# Altium schematic sheet FMC_130MSPS_4CH.SchDoc: FMC 130MSPS 4CH
size 420 x 297 mm; SheetNumber: 1; SheetTotal: 8
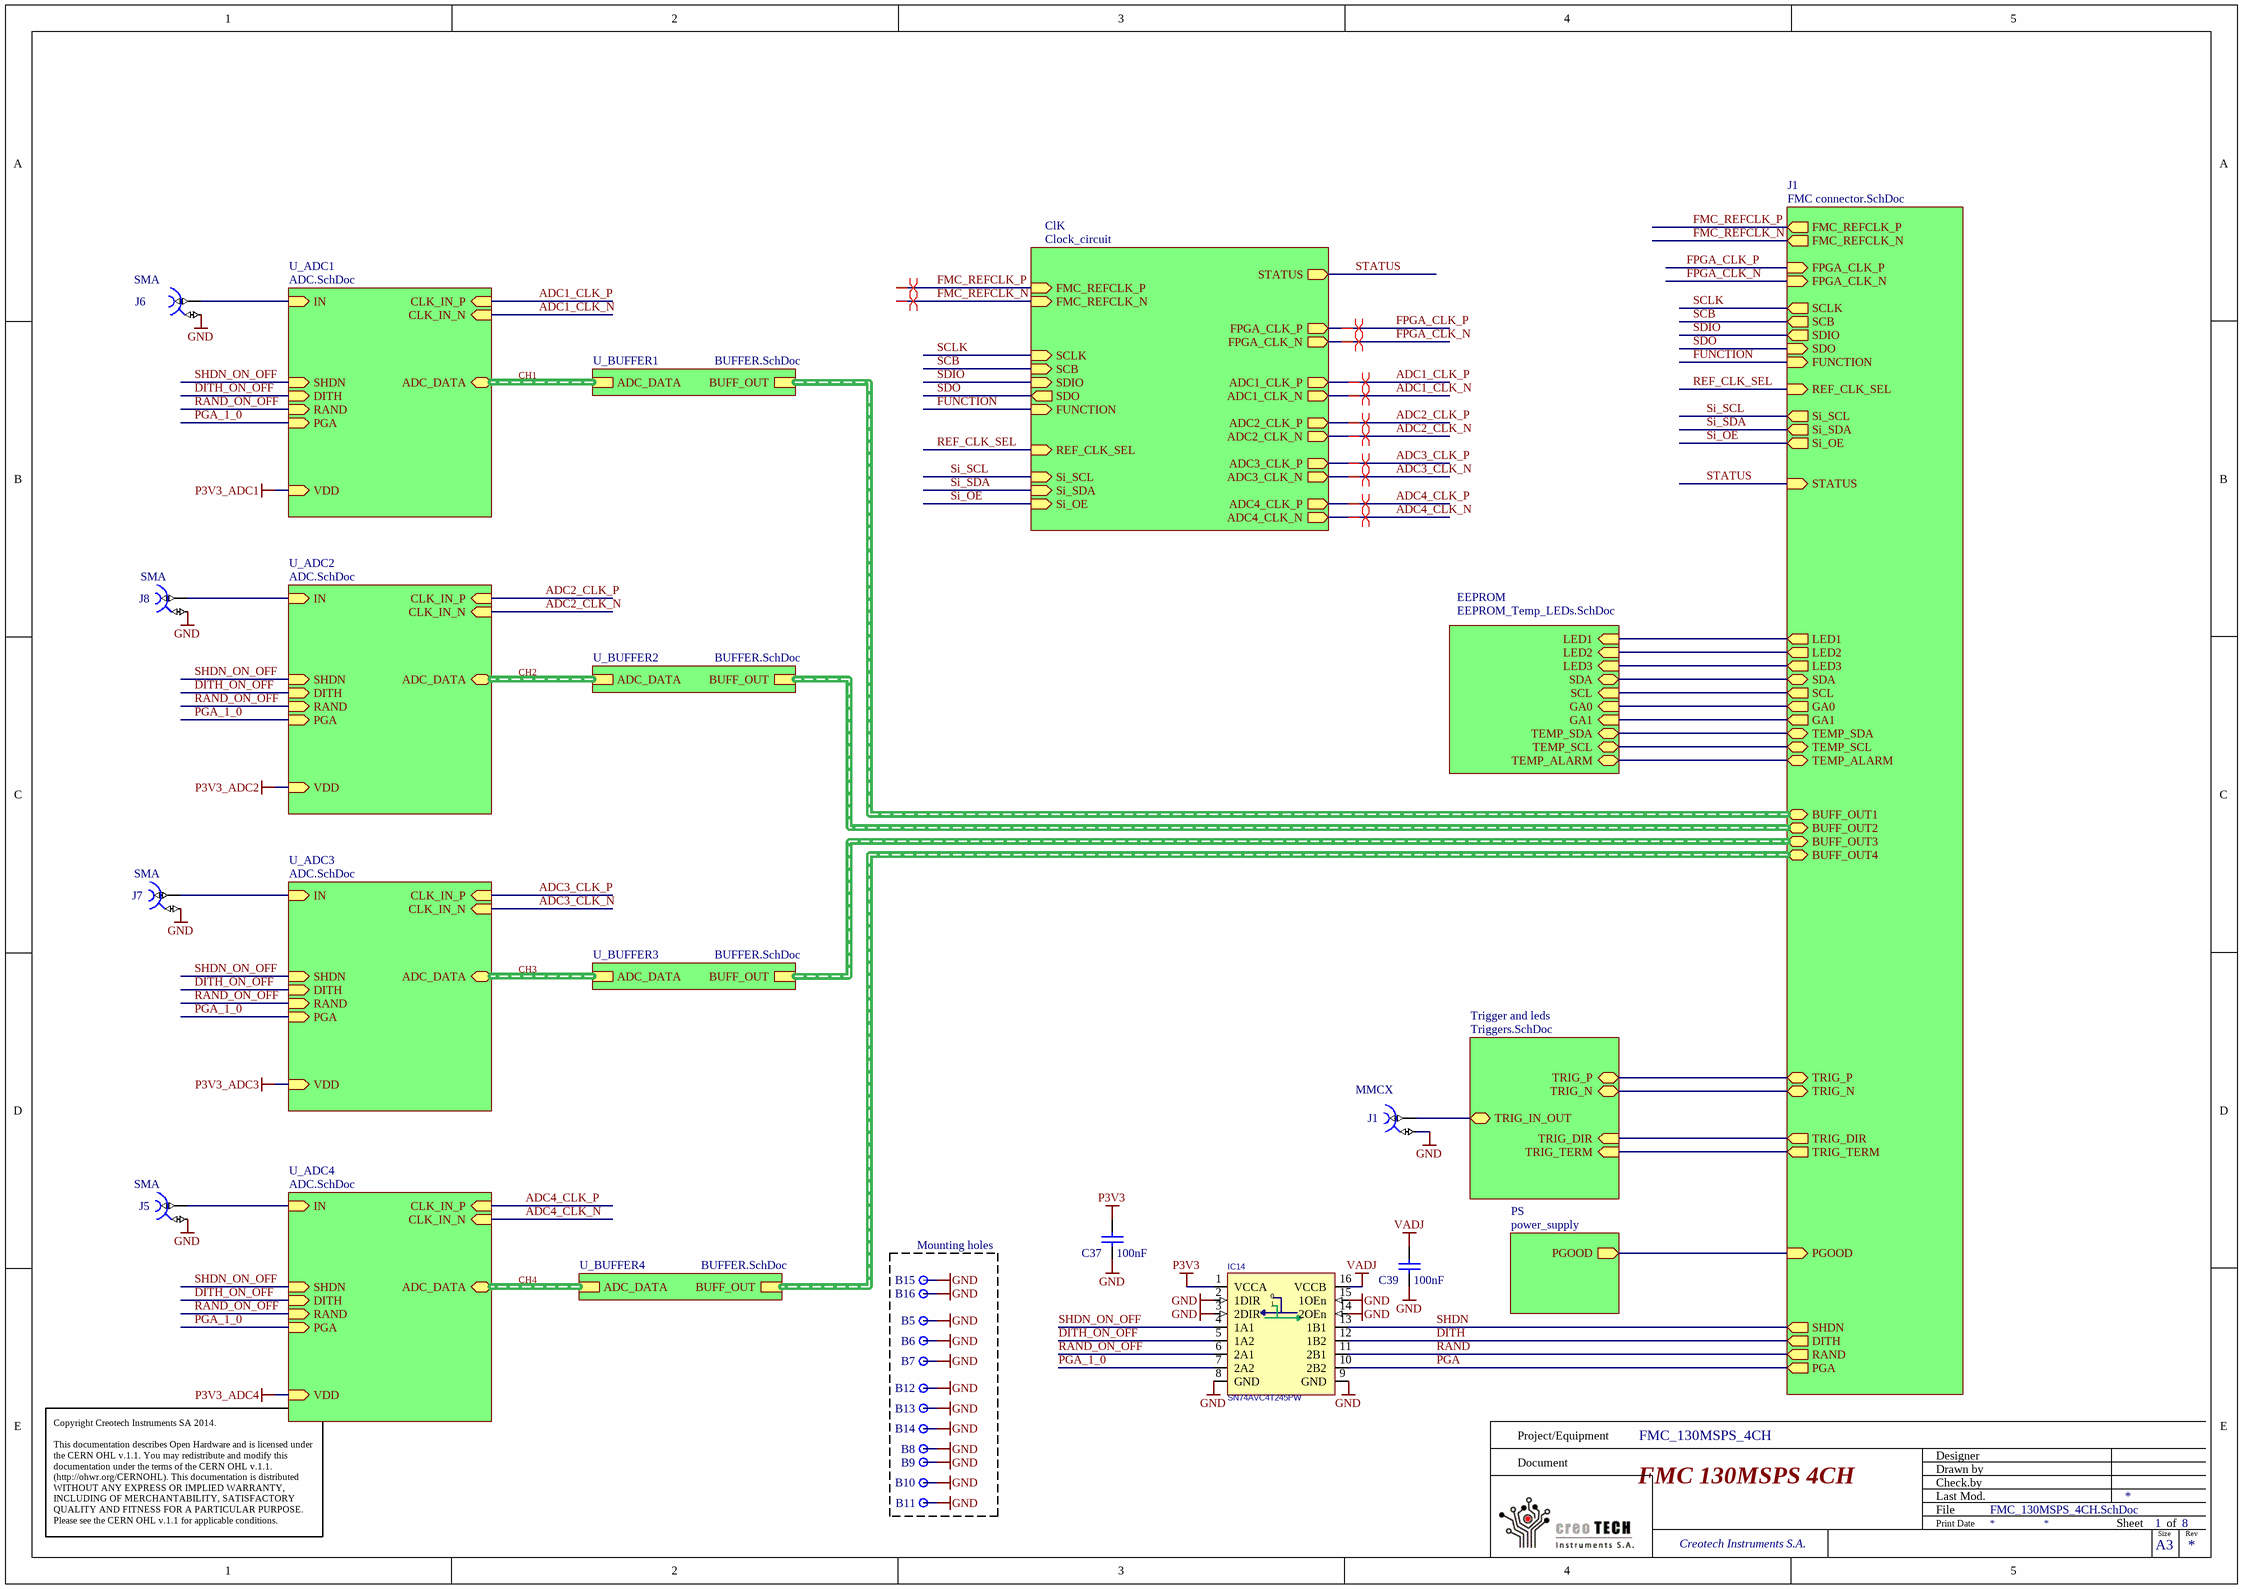
[diagram p0: FMC_130MSPS_4CH.SchDoc]

## Parts
B5  Plated Hole  [MTG240_400]  (value not drawn)  (no BOM)
B6  Plated Hole  [MTG240_400]  (value not drawn)  (no BOM)
B7  Plated Hole  [MTG240_400]  (value not drawn)  (no BOM)
B8  Plated Hole  [MTG240_400]  (value not drawn)  (no BOM)
B9  Plated Hole  [MTG240_400]  (value not drawn)  (no BOM)
B10  Plated Hole  [MTG240_400]  (value not drawn)  (no BOM)
B11  Plated Hole  [MTG240_400]  (value not drawn)  (no BOM)
B12  Plated Hole  [MTG240_400]  (value not drawn)  (no BOM)
B13  Plated Hole  [MTG240_400]  (value not drawn)  (no BOM)
B14  Plated Hole  [MTG240_400]  (value not drawn)  (no BOM)
B15  Plated Hole  [MTG240_400]  (value not drawn)  (no BOM)
B16  Plated Hole  [MTG240_400]  (value not drawn)  (no BOM)
C37  100nF  [CAPC0603X33N]
C39  100nF  [CAPC0603X33N]
IC14  SN74AVC4T245PW  [TSSOP-16]
J1  Family: MMCX  [HUBER-SUHNER_85_MMCX-50-0-1/111 OH]  (hidden comment: Coax_1Female_1Shield)
J5  Family: SMA  [JOHNSON_142-0711-301]  (hidden comment: Coax_1Female_1Shield)
J6  Family: SMA  [JOHNSON_142-0711-301]  (hidden comment: Coax_1Female_1Shield)
J7  Family: SMA  [JOHNSON_142-0711-301]  (hidden comment: Coax_1Female_1Shield)
J8  Family: SMA  [JOHNSON_142-0711-301]  (hidden comment: Coax_1Female_1Shield)

## Blocks framed on the sheet
Mounting holes: B5-B16

## Sub-sheets
ClK = Clock_circuit: FPGA_CLK_P (out), FPGA_CLK_N (out), Si_SDA (in), Si_SCL (in), Si_OE (in), ADC1_CLK_P (out), ADC1_CLK_N (out), ADC2_CLK_P (out), ADC2_CLK_N (out), ADC3_CLK_P (out), ADC3_CLK_N (out), ADC4_CLK_P (out), ADC4_CLK_N (out), SCLK (in), SCB (in), SDIO (in), SDO (out), STATUS (out), FUNCTION (in), FMC_REFCLK_P (in), FMC_REFCLK_N (in), REF_CLK_SEL (in)
EEPROM = EEPROM_Temp_LEDs.SchDoc: LED1 (in), LED2 (in), SDA (bidir), SCL (in), GA0 (in), GA1 (in), LED3 (in), TEMP_SDA (bidir), TEMP_SCL (bidir), TEMP_ALARM (bidir)
J1 = FMC connector.SchDoc: BUFF_OUT1 (harness BUFF_OUT), BUFF_OUT2 (harness BUFF_OUT), BUFF_OUT4 (harness BUFF_OUT), BUFF_OUT3 (harness BUFF_OUT), SHDN (out), DITH (out), RAND (out), PGA (out), PGOOD (in), TRIG_DIR (out), TRIG_TERM (out), FMC_REFCLK_P (out), FMC_REFCLK_N (out), Si_SDA (out), Si_SCL (out), Si_OE (out), SCLK (out), SCB (out), SDIO (out), SDO (in), FUNCTION (in), STATUS (in), FPGA_CLK_P (in), FPGA_CLK_N (in), TRIG_N (bidir), TRIG_P (bidir), REF_CLK_SEL (in), LED1 (out), LED2 (out), SDA (bidir), SCL (out), GA0 (out), GA1 (out), LED3 (out), TEMP_SDA (bidir), TEMP_SCL (bidir), TEMP_ALARM (bidir)
PS = power_supply: PGOOD (out)
Trigger and leds = Triggers.SchDoc: TRIG_DIR (in), TRIG_N (bidir), TRIG_P (bidir), TRIG_TERM (in), TRIG_IN_OUT (bidir)
U_ADC1 = ADC.SchDoc: SHDN (in), IN (in), DITH (in), RAND (in), VDD, CLK_IN_P (in), CLK_IN_N (in), PGA (in), ADC_DATA (harness ADC_DATA)
U_ADC2 = ADC.SchDoc: SHDN (in), IN (in), DITH (in), RAND (in), VDD, CLK_IN_P (in), CLK_IN_N (in), PGA (in), ADC_DATA (harness ADC_DATA)
U_ADC3 = ADC.SchDoc: SHDN (in), IN (in), DITH (in), RAND (in), VDD, CLK_IN_P (in), CLK_IN_N (in), PGA (in), ADC_DATA (harness ADC_DATA)
U_ADC4 = ADC.SchDoc: SHDN (in), IN (in), DITH (in), RAND (in), VDD, CLK_IN_P (in), CLK_IN_N (in), PGA (in), ADC_DATA (harness ADC_DATA)
U_BUFFER1 = BUFFER.SchDoc: BUFF_OUT (harness BUFF_OUT), ADC_DATA (harness ADC_DATA)
U_BUFFER2 = BUFFER.SchDoc: BUFF_OUT (harness BUFF_OUT), ADC_DATA (harness ADC_DATA)
U_BUFFER3 = BUFFER.SchDoc: BUFF_OUT (harness BUFF_OUT), ADC_DATA (harness ADC_DATA)
U_BUFFER4 = BUFFER.SchDoc: BUFF_OUT (harness BUFF_OUT), ADC_DATA (harness ADC_DATA)

## Nets
GND: B5.1 B6.1 B7.1 B8.1 B9.1 B10.1 B11.1 B12.1 B13.1 B14.1 B15.1 B16.1 C37.1 C39.1 IC14.2(1DIR) IC14.3(2DIR) IC14.8(GND) IC14.9(GND) IC14.14(2OEn) IC14.15(1OEn) J1.2 J5.2 J6.2 J7.2 J8.2
P3V3: C37.2 IC14.1(VCCA)
P3V3_ADC1: sheet U_ADC1/VDD
P3V3_ADC2: sheet U_ADC2/VDD
P3V3_ADC3: sheet U_ADC3/VDD
P3V3_ADC4: sheet U_ADC4/VDD
VADJ: C39.2 IC14.16(VCCB)
ADC1_CLK_N: sheet ClK/ADC1_CLK_N, sheet U_ADC1/CLK_IN_N
ADC1_CLK_P: sheet ClK/ADC1_CLK_P, sheet U_ADC1/CLK_IN_P
ADC2_CLK_N: sheet ClK/ADC2_CLK_N, sheet U_ADC2/CLK_IN_N
ADC2_CLK_P: sheet ClK/ADC2_CLK_P, sheet U_ADC2/CLK_IN_P
ADC3_CLK_N: sheet ClK/ADC3_CLK_N, sheet U_ADC3/CLK_IN_N
ADC3_CLK_P: sheet ClK/ADC3_CLK_P, sheet U_ADC3/CLK_IN_P
ADC4_CLK_N: sheet ClK/ADC4_CLK_N, sheet U_ADC4/CLK_IN_N
ADC4_CLK_P: sheet ClK/ADC4_CLK_P, sheet U_ADC4/CLK_IN_P
DITH: IC14.12(1B2) ; sheet J1/DITH
DITH_ON_OFF: IC14.5(1A2) ; sheet U_ADC1/DITH, sheet U_ADC2/DITH, sheet U_ADC3/DITH, sheet U_ADC4/DITH
FMC_REFCLK_N: sheet J1/FMC_REFCLK_N, sheet ClK/FMC_REFCLK_N
FMC_REFCLK_P: sheet J1/FMC_REFCLK_P, sheet ClK/FMC_REFCLK_P
FPGA_CLK_N: sheet J1/FPGA_CLK_N, sheet ClK/FPGA_CLK_N
FPGA_CLK_P: sheet J1/FPGA_CLK_P, sheet ClK/FPGA_CLK_P
FUNCTION: sheet J1/FUNCTION, sheet ClK/FUNCTION
PGA: IC14.10(2B2) ; sheet J1/PGA
PGA_1_0: IC14.7(2A2) ; sheet U_ADC1/PGA, sheet U_ADC2/PGA, sheet U_ADC3/PGA, sheet U_ADC4/PGA
RAND: IC14.11(2B1) ; sheet J1/RAND
RAND_ON_OFF: IC14.6(2A1) ; sheet U_ADC1/RAND, sheet U_ADC2/RAND, sheet U_ADC3/RAND, sheet U_ADC4/RAND
REF_CLK_SEL: sheet J1/REF_CLK_SEL, sheet ClK/REF_CLK_SEL
SCB: sheet J1/SCB, sheet ClK/SCB
SCLK: sheet J1/SCLK, sheet ClK/SCLK
SDIO: sheet J1/SDIO, sheet ClK/SDIO
SDO: sheet J1/SDO, sheet ClK/SDO
SHDN: IC14.13(1B1) ; sheet J1/SHDN
SHDN_ON_OFF: IC14.4(1A1) ; sheet U_ADC1/SHDN, sheet U_ADC2/SHDN, sheet U_ADC3/SHDN, sheet U_ADC4/SHDN
Si_OE: sheet J1/Si_OE, sheet ClK/Si_OE
Si_SCL: sheet J1/Si_SCL, sheet ClK/Si_SCL
Si_SDA: sheet J1/Si_SDA, sheet ClK/Si_SDA
STATUS: sheet J1/STATUS, sheet ClK/STATUS
NetJ1_1: J1.1 ; sheet Trigger and leds/TRIG_IN_OUT
NetJ5_1: J5.1 ; sheet U_ADC4/IN
NetJ6_1: J6.1 ; sheet U_ADC1/IN
NetJ7_1: J7.1 ; sheet U_ADC3/IN
NetJ8_1: J8.1 ; sheet U_ADC2/IN
(unnamed): sheet PS/PGOOD, sheet J1/PGOOD
(unnamed): sheet J1/TRIG_DIR, sheet Trigger and leds/TRIG_DIR
(unnamed): sheet J1/TRIG_TERM, sheet Trigger and leds/TRIG_TERM
(unnamed): sheet J1/TRIG_N, sheet Trigger and leds/TRIG_N
(unnamed): sheet J1/TRIG_P, sheet Trigger and leds/TRIG_P
(unnamed): sheet J1/LED1, sheet EEPROM/LED1
(unnamed): sheet J1/LED2, sheet EEPROM/LED2
(unnamed): sheet J1/SDA, sheet EEPROM/SDA
(unnamed): sheet J1/SCL, sheet EEPROM/SCL
(unnamed): sheet J1/GA0, sheet EEPROM/GA0
(unnamed): sheet J1/GA1, sheet EEPROM/GA1
(unnamed): sheet J1/LED3, sheet EEPROM/LED3
(unnamed): sheet J1/TEMP_SDA, sheet EEPROM/TEMP_SDA
(unnamed): sheet J1/TEMP_SCL, sheet EEPROM/TEMP_SCL
(unnamed): sheet J1/TEMP_ALARM, sheet EEPROM/TEMP_ALARM

## Buses and harness runs
harness CH1 = sheet U_ADC1/ADC_DATA = sheet U_BUFFER1/ADC_DATA
harness CH2 = sheet U_ADC2/ADC_DATA = sheet U_BUFFER2/ADC_DATA
harness CH3 = sheet U_ADC3/ADC_DATA = sheet U_BUFFER3/ADC_DATA
harness CH4 = sheet U_ADC4/ADC_DATA = sheet U_BUFFER4/ADC_DATA
harness sheet J1/BUFF_OUT1 = sheet U_BUFFER1/BUFF_OUT
harness sheet J1/BUFF_OUT2 = sheet U_BUFFER2/BUFF_OUT
harness sheet J1/BUFF_OUT3 = sheet U_BUFFER3/BUFF_OUT
harness sheet J1/BUFF_OUT4 = sheet U_BUFFER4/BUFF_OUT

## Layout directives
differential pair: ADC1_CLK_N, ADC1_CLK_P, ADC2_CLK_N, ADC2_CLK_P, ADC3_CLK_N, ADC3_CLK_P, ADC4_CLK_N, ADC4_CLK_P, FMC_REFCLK_N, FMC_REFCLK_P, FPGA_CLK_N, FPGA_CLK_P

## Notes on the sheet
- Project/Equipment
- Document
- FMC_130MSPS_4CH
- Designer
- Drawn by
- Check.by
- Copyright Creotech Instruments SA 2014.
  This documentation describes Open Hardware and is licensed under the CERN OHL v.1.1. You may redistribute and modify this documentation under the terms of the CERN OHL v.1.1. (http://ohwr.org/CERNOHL). This documentation is distributed WITHOUT ANY EXPRESS OR IMPLIED WARRANTY, INCLUDING OF MERCHANTABILITY, SATISFACTORY QUALITY AND FITNESS FOR A PARTICULAR PURPOSE. Please see the CERN OHL v.1.1 for applicable conditions.
- Creotech Instruments S.A.
- File
- Last Mod.
- Print Date
- Sheet
- Size
- A3
- of
- Rev
- (in symbol 74AVC4T245) 0

## Library data of the parts
B5-B16 = PLATED_HOLE2.4_PAD4.0: Single Terminal Socket; Part Description: Plated Through Hole: Hole Dia.=2.4mm Pad Dia.=4.0mm; Mounted: No; Table: Pads; Part Number: PLATED_HOLE2.4_PAD4.0; Component Type: Standard (No BOM); Pin Count: 1; Family: Plated Hole; Socket: No; SMD: No; Status: None; ComponentHeight: 0mm; Author: CERN DEM JMW; CreateDate: 2011-10-10; LatestRevisionDate: 2011-10-10; PackageDescription: Plated Through Hole: Hole Dia.=2.4mm Pad Dia.=4.0mm
C37 C39 = CC0201_100NF_6.3V_10%_X5R: Non-polarised capacitor; Part Description: SMD Multilayer Chip Ceramic Capacitor; Manufacturer: GENERIC; Manufacturer1 Part Number: 02016D104KAT2A; Voltage: 6.3V; TC: X5R; Tolerance: ±10%; Table: Capacitors SMD; Part Number: CC0201_100NF_6.3V_10%_X5R; Component Kind: Standard; Component Type: Standard; Pin Count: 2; Value: 100nF; Status: Not Recommended; Manufacturer Part Number: CC0201_100NF_6.3V_10%_X5R; Case: 0201; Mounted: Yes; Socket: No; SMD: Yes; Manufacturer1 Example: AVX; Manufacturer1 ComponentHeight: 0.33mm; HelpURL: \\cern.ch\dfs\Applications\Altium\Datasheets\CC0201_X5R_AVX.pdf; Author: CERN DEM JLC; CreateDate: 2007-12-03; LatestRevisionDate: 2007-12-03
IC14 = 74AVC4T245: 4-BIT DUAL-SUPPLY BUS TRANSCEIVER
J1 = HUBER-SUHNER_85_MMCX-50-0-1/111 OH: Part Description: MMCX 50 Ohms Right Angle PCB Jack; Manufacturer: HUBER+SUHNER; Table: Miscellaneous; Part Number: HUBER-SUHNER_85_MMCX-50-0-1/111 OH; Component Kind: Standard; Component Type: Standard; Pin Count: 2; Mounted: Yes; Socket: No; SMD: No; Status: None; Manufacturer Part Number: 85_MMCX-50-0-1/111 OH; ComponentHeight: 9.6mm; HelpURL: \\cern.ch\dfs\Applications\Altium\Datasheets\HUBER-SUHNER_85_MMCX-50-0-1-111 OH.pdf; Author: CERN DEM JLC; CreateDate: 4/10/2011; LatestRevisionDate: 4/10/2011
J5-J8 = JOHNSON_142-0711-301: Part Description: SMA 50 Ohms Right Angled Jack Receptacle - Surface Mount; Table: Miscellaneous; Part Number: JOHNSON_142-0711-301; Component Kind: Standard; Component Type: Standard; Pin Count: 2; Mounted: Yes; Socket: No; SMD: Yes; Status: None; Manufacturer: JOHNSON; Manufacturer Part Number: 142-0711-301; ComponentHeight: 8.26mm; HelpURL: \\cern.ch\dfs\Applications\Altium\Datasheets\JOHNSON_142-0711-301.pdf; Author: CERN DEM JLC; CreateDate: 15/10/2012; LatestRevisionDate: 15/10/2012